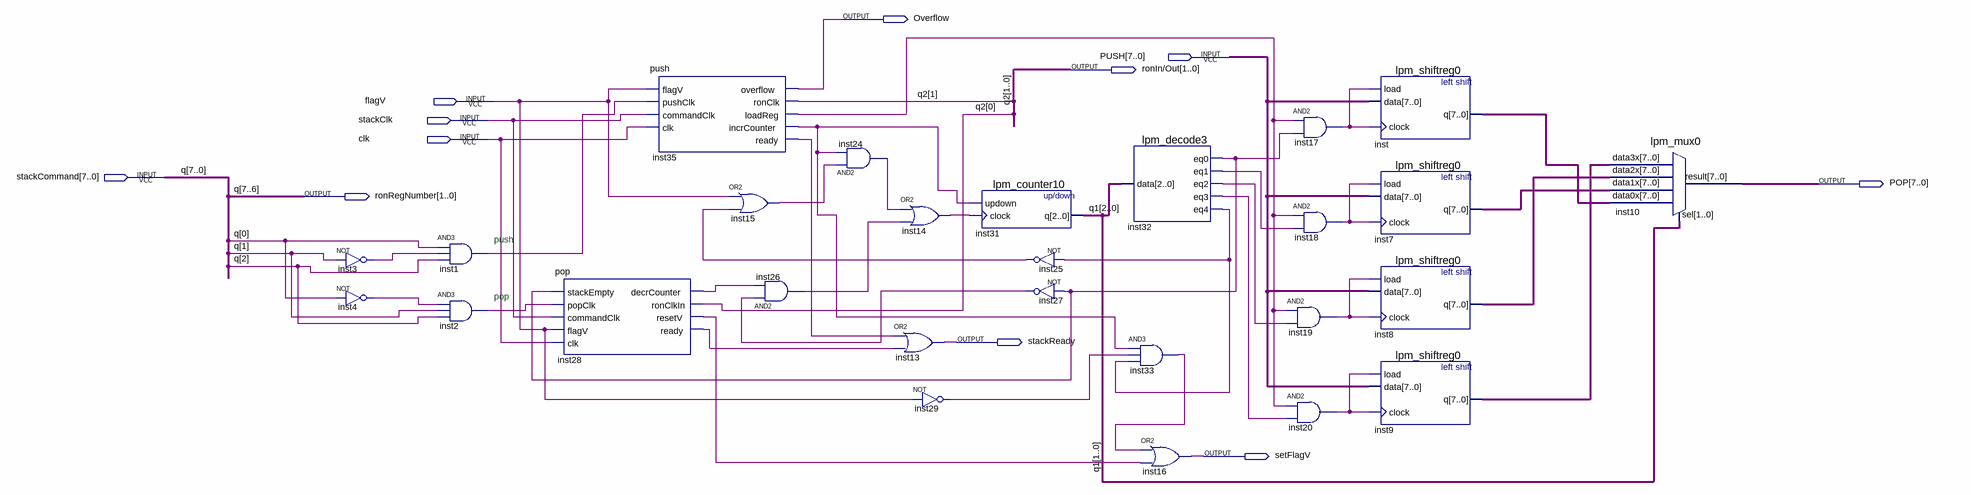
[diagram p0: schematic sheet]
// Quartus schematic stack.bdf as structural Verilog: 27 symbols, 11 pins
module stack (
  input  [7:0] PUSH,
  input  flagV,
  input  stackClk,
  input  clk,
  input  [7:0] stackCommand,
  output Overflow,
  output [1:0] \ronIn/Out ,
  output [7:0] POP,
  output [1:0] ronRegNumber,
  output stackReady,
  output setFlagV
);

  wire inst1_out, inst2_out, inst3_out, inst4_out, inst14_out, inst15_out, inst17_out, inst18_out,
       inst19_out, inst20_out, inst24_out, inst25_out, inst26_out, inst27_out, inst28_decrcounter,
       inst28_ready, inst28_resetv, inst29_out, inst32_eq0, inst32_eq1, inst32_eq2, inst32_eq3, inst32_eq4,
       inst33_out, inst35_incrcounter, inst35_loadreg, inst35_ready;
  wire [2:0] q1;
  wire [7:0] inst7_q, inst8_q, inst9_q, inst_q;

  not inst3 (inst3_out, stackCommand[1]);
  not inst4 (inst4_out, stackCommand[0]);
  and inst1 (inst1_out, stackCommand[0], inst3_out, stackCommand[2]);
  and inst2 (inst2_out, inst4_out, stackCommand[1], stackCommand[2]);
  pop inst28 (
    .stackEmpty(inst32_eq0), .popClk(inst2_out), .commandClk(stackClk), .flagV(flagV), .clk(clk),
    .decrCounter(inst28_decrcounter), .ronClkIn(\ronIn/Out [0]), .resetV(inst28_resetv), .ready(inst28_ready));
  push inst35 (
    .flagV(flagV), .pushClk(inst1_out), .commandClk(stackClk), .clk(clk), .overflow(Overflow),
    .ronClk(\ronIn/Out [1]), .loadReg(inst35_loadreg), .incrCounter(inst35_incrcounter), .ready(inst35_ready));
  or inst15 (inst15_out, flagV, inst25_out);
  and inst26 (inst26_out, inst27_out, inst28_decrcounter);
  and inst24 (inst24_out, inst15_out, inst35_incrcounter);
  or inst14 (inst14_out, inst24_out, inst26_out);
  or inst13 (stackReady, inst35_ready, inst28_ready);
  not inst29 (inst29_out, flagV);
  lpm_counter10 inst31 (.updown(inst35_incrcounter), .clock(inst14_out), .q(q1));
  not inst25 (inst25_out, inst32_eq4);
  not inst27 (inst27_out, inst32_eq0);
  lpm_decode3 inst32 (
    .data(q1), .eq0(inst32_eq0), .eq1(inst32_eq1), .eq2(inst32_eq2), .eq3(inst32_eq3), .eq4(inst32_eq4));
  and inst33 (inst33_out, inst35_incrcounter, inst29_out, inst32_eq4);
  or inst16 (setFlagV, inst33_out, inst28_resetv);
  and inst17 (inst17_out, inst35_loadreg, inst32_eq0);
  and inst18 (inst18_out, inst35_loadreg, inst32_eq1);
  and inst19 (inst19_out, inst35_loadreg, inst32_eq2);
  and inst20 (inst20_out, inst35_loadreg, inst32_eq3);
  lpm_shiftreg0 inst (.load(inst17_out), .data(PUSH), .clock(inst17_out), .q(inst_q));
  lpm_shiftreg0 inst7 (.load(inst18_out), .data(PUSH), .clock(inst18_out), .q(inst7_q));
  lpm_shiftreg0 inst8 (.load(inst19_out), .data(PUSH), .clock(inst19_out), .q(inst8_q));
  lpm_shiftreg0 inst9 (.load(inst20_out), .data(PUSH), .clock(inst20_out), .q(inst9_q));
  lpm_mux0 inst10 (.data3x(inst9_q), .data2x(inst8_q), .data1x(inst7_q), .data0x(inst_q), .sel(q1[1:0]), .result(POP));

  assign ronRegNumber = stackCommand[7:6];

  // Other names for the same wires on the sheet: q[7:0] = stackCommand; q2[1:0] = \ronIn/Out 

  // Notes on the sheet:
  //   push
  //   pop
endmodule
